# EAGLE schematic Schematic (EAGLE 9.6.2)
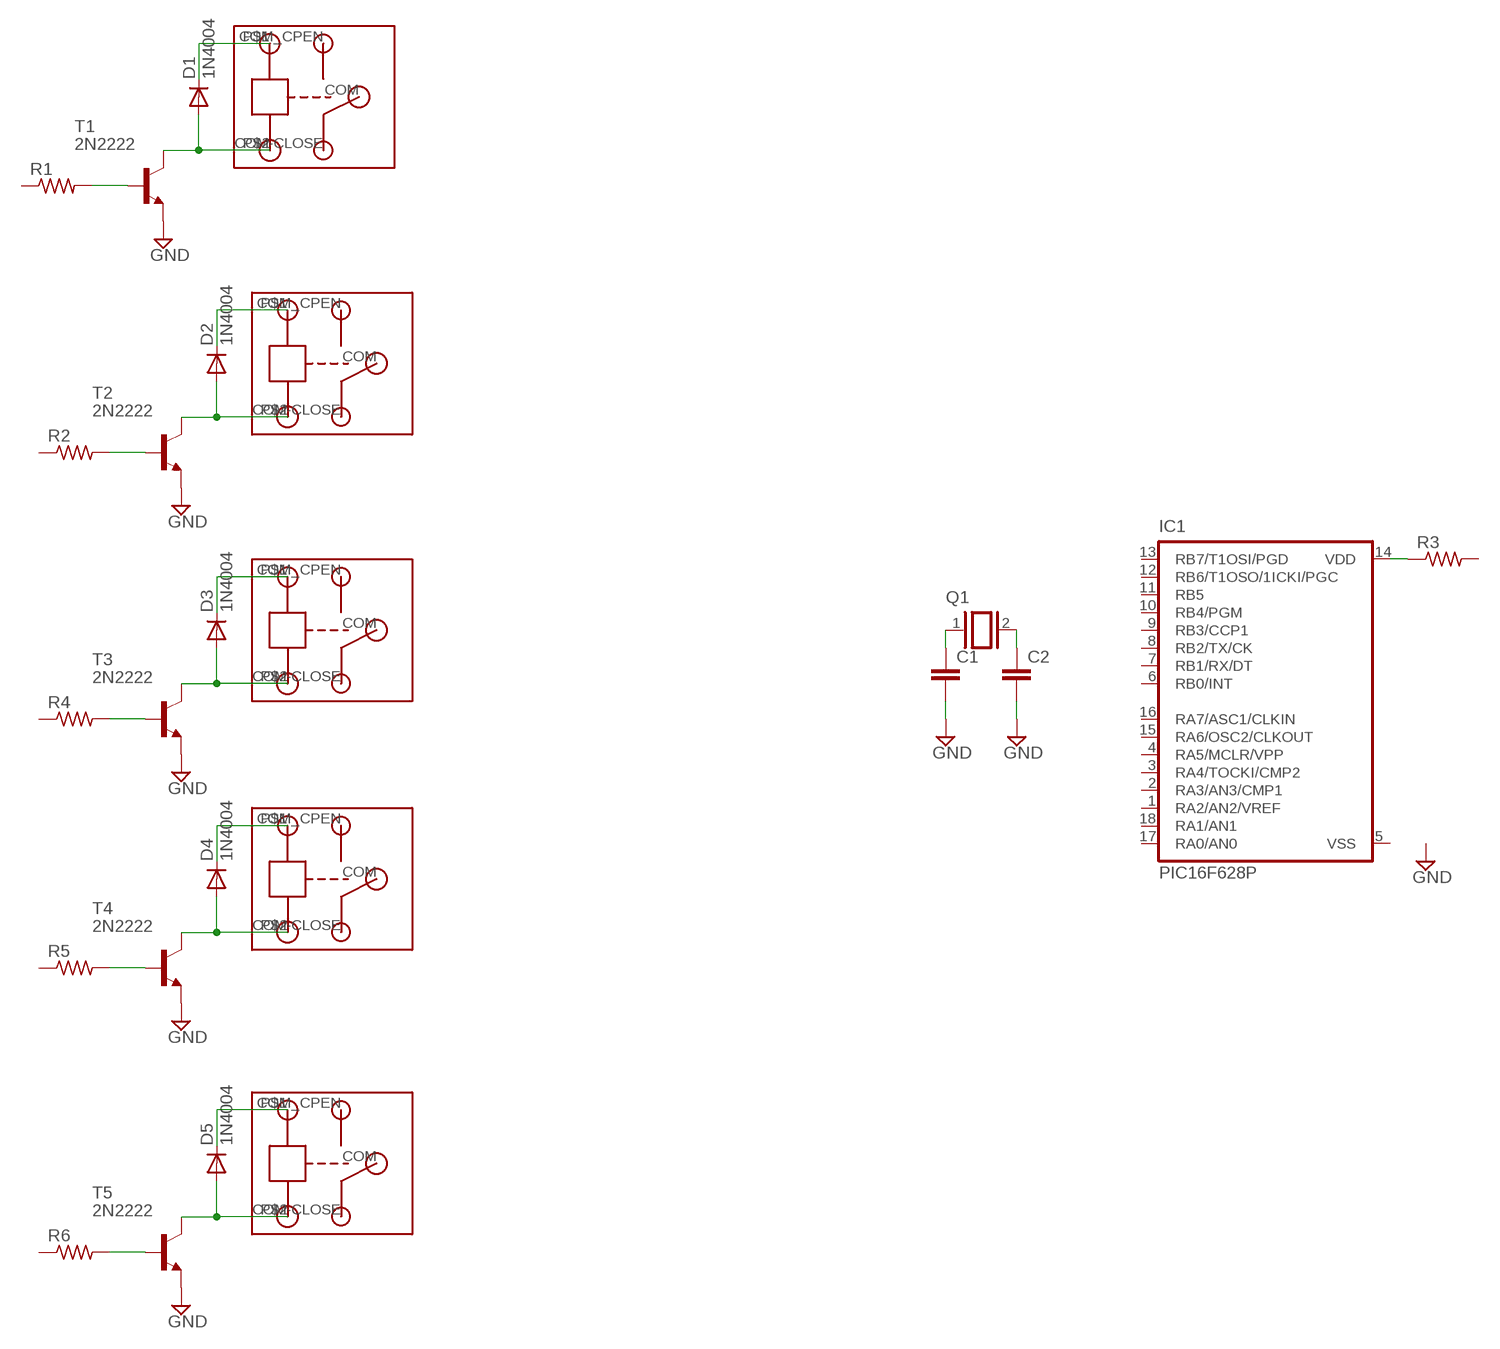
[diagram p0: schematic, sheet 1]

## Parts
C1  C2,5-3  [C2.5-3]
C2  C2,5-3  [C2.5-3]
D1  1N4004  [DO41-10]
D2  1N4004  [DO41-10]
D3  1N4004  [DO41-10]
D4  1N4004  [DO41-10]
D5  1N4004  [DO41-10]
IC1  PIC16F628P  [DIL18]
Q1  XTAL  [Q]
R1  R-US_0207/7  [0207/7]
R2  R-US_0207/7  [0207/7]
R3  R-US_0207/12  [0207/12]
R4  R-US_0207/7  [0207/7]
R5  R-US_0207/7  [0207/7]
R6  R-US_0207/7  [0207/7]
T1  2N2222  [TO92-EBC-OVAL]
T2  2N2222  [TO92-EBC-OVAL]
T3  2N2222  [TO92-EBC-OVAL]
T4  2N2222  [TO92-EBC-OVAL]
T5  2N2222  [TO92-EBC-OVAL]
U$1  RELAY  [RELAY]
U$2  RELAY  [RELAY]
U$3  RELAY  [RELAY]
U$4  RELAY  [RELAY]
U$5  RELAY  [RELAY]

## Nets
GND: C1.2 C2.2 T1.E T2.E T3.E T4.E T5.E
N$1: C1.1 Q1.1
N$2: C2.1 Q1.2
N$3: IC1.14(VDD) R3.1
N$4: D1.A T1.C U$1.P$2(GND)
N$5: D1.C U$1.P$1(IN)
N$6: R1.2 T1.B
N$7: D2.A T2.C U$2.P$2(GND)
N$8: D2.C U$2.P$1(IN)
N$9: R2.2 T2.B
N$10: D3.A T3.C U$3.P$2(GND)
N$11: D3.C U$3.P$1(IN)
N$12: R4.2 T3.B
N$13: D4.A T4.C U$4.P$2(GND)
N$14: D4.C U$4.P$1(IN)
N$15: R5.2 T4.B
N$16: D5.A T5.C U$5.P$2(GND)
N$17: D5.C U$5.P$1(IN)
N$18: R6.2 T5.B
Unconnected: IC1.1(RA2/AN2/VREF) IC1.2(RA3/AN3/CMP1) IC1.3(RA4/TOCKI/CMP2) IC1.4(RA5/MCLR/VPP) IC1.6(RB0/INT) IC1.7(RB1/RX/DT) IC1.8(RB2/TX/CK) IC1.9(RB3/CCP1) IC1.10(RB4/PGM) IC1.11(RB5) IC1.12(RB6/T1OSO/1ICKI/PGC) IC1.13(RB7/T1OSI/PGD) IC1.15(RA6/OSC2/CLKOUT) IC1.16(RA7/ASC1/CLKIN) IC1.17(RA0/AN0) IC1.18(RA1/AN1) R1.1 R2.1 R3.2 R4.1 R5.1 R6.1 U$1.COM U$1.COM-CLOSE U$1.COM_CPEN(COM-OPEN) U$2.COM U$2.COM-CLOSE U$2.COM_CPEN(COM-OPEN) U$3.COM U$3.COM-CLOSE U$3.COM_CPEN(COM-OPEN) U$4.COM U$4.COM-CLOSE U$4.COM_CPEN(COM-OPEN) U$5.COM U$5.COM-CLOSE U$5.COM_CPEN(COM-OPEN)

## Power pins joined to a net without a drawn wire
VSS: IC1.5(VSS)

## Library data of the parts
C1 C2 = capacitor-wima:C: CAPACITOR naming: grid - package width
D1-D5 = adafruit:1N4004: DIODE General purpose 1N400x type rectifier (With bigger pads) http://www.ladyada.net/library/pcb/eaglelibrary.html
IC1 = microchip:PIC16*F62: FLASH-Based 8-Bit CMOS Microcontroller Source: http://ww1.microchip.com/downloads/en/DeviceDoc/40300C.pdf; MF: MICROCHIP; MPN: PIC16F628-20/P; OC_FARNELL: 9760423; OC_NEWARK: 23C4982
Q1 = special:XTAL: CRYSTAL
R1-R6 = adafruit:R-US_: RESISTOR, American symbol
T1-T5 = adafruit:2N2222: NPN TRANSISTOR Big oval pads
U$1-U$5 = RELAY:RELAY